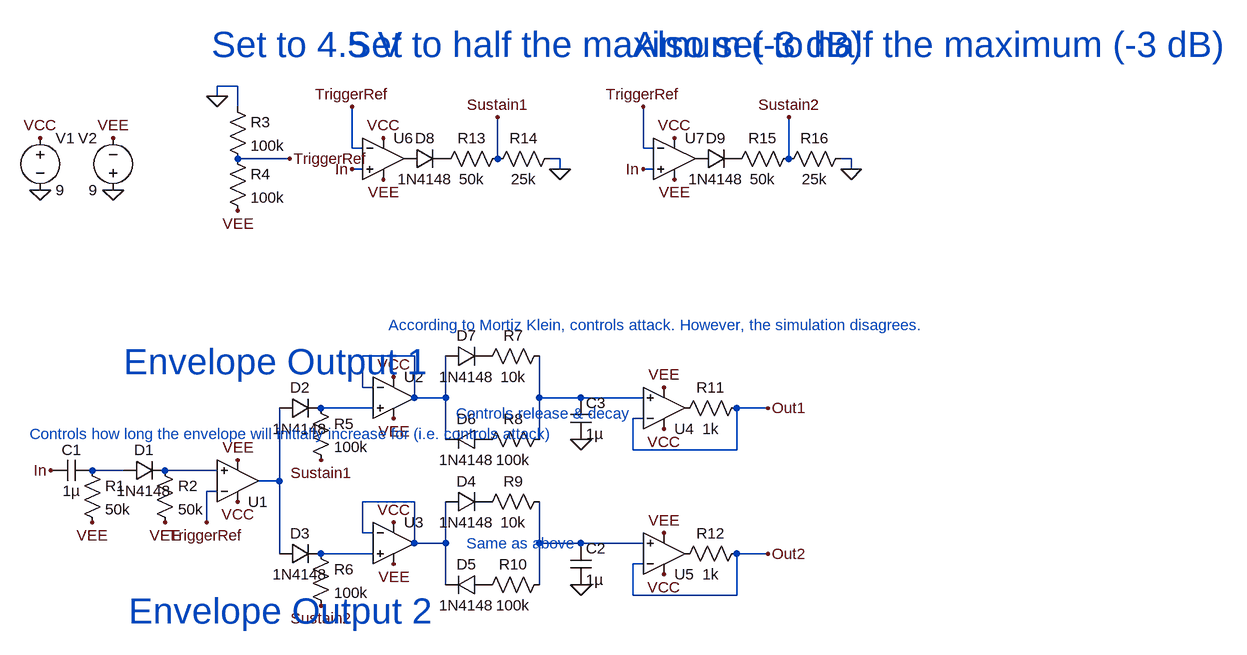
[diagram p0: schematic Envelope Generator.asc]
Envelope Generator.asc, the LTspice schematic file:
Version 4.1
SHEET 1 1356 680
WIRE 336 -496 304 -496
WIRE 304 -480 304 -496
WIRE 336 -464 336 -496
WIRE 512 -400 512 -464
WIRE 528 -400 512 -400
WIRE 960 -400 960 -464
WIRE 976 -400 960 -400
WIRE 416 -384 336 -384
WIRE 736 -384 736 -448
WIRE 832 -384 816 -384
WIRE 1184 -384 1184 -448
WIRE 1280 -384 1264 -384
WIRE 528 -368 512 -368
WIRE 832 -368 832 -384
WIRE 976 -368 960 -368
WIRE 1280 -368 1280 -384
WIRE 608 -80 528 -80
WIRE 528 -32 528 -80
WIRE 544 -32 528 -32
WIRE 608 -16 608 -80
WIRE 656 -16 656 -80
WIRE 656 -16 608 -16
WIRE 800 -16 800 -80
WIRE 864 -16 800 -16
WIRE 960 -16 864 -16
WIRE 544 0 464 0
WIRE 1152 0 1104 0
WIRE 960 16 944 16
WIRE 656 48 656 -16
WIRE 800 48 800 -16
WIRE 944 64 944 16
WIRE 1104 64 1104 0
WIRE 1104 64 944 64
WIRE 160 96 112 96
WIRE 304 96 224 96
WIRE 400 112 400 0
WIRE 400 112 368 112
WIRE 304 128 288 128
WIRE 608 144 528 144
WIRE 288 176 288 128
WIRE 528 192 528 144
WIRE 544 192 528 192
WIRE 608 208 608 144
WIRE 656 208 656 144
WIRE 656 208 608 208
WIRE 800 208 800 144
WIRE 864 208 800 208
WIRE 960 208 864 208
WIRE 400 224 400 112
WIRE 544 224 464 224
WIRE 1152 224 1104 224
WIRE 960 240 944 240
WIRE 656 272 656 208
WIRE 800 272 800 208
WIRE 944 288 944 240
WIRE 1104 288 1104 224
WIRE 1104 288 944 288
FLAG 48 96 In
FLAG 288 176 TriggerRef
FLAG 336 144 VCC
FLAG 336 80 VEE
FLAG 304 -480 0
FLAG 336 -304 VEE
FLAG 416 -384 TriggerRef
FLAG 32 -336 0
FLAG 144 -336 0
FLAG 144 -416 VEE
FLAG 32 -416 VCC
FLAG 464 80 Sustain1
FLAG 464 304 Sustain2
FLAG 576 -48 VCC
FLAG 576 176 VCC
FLAG 576 16 VEE
FLAG 576 240 VEE
FLAG 864 48 0
FLAG 864 272 0
FLAG 992 -32 VEE
FLAG 992 32 VCC
FLAG 992 192 VEE
FLAG 992 256 VCC
FLAG 1152 0 Out1
FLAG 1152 224 Out2
FLAG 512 -464 TriggerRef
FLAG 512 -368 In
FLAG 832 -368 0
FLAG 736 -448 Sustain1
FLAG 560 -416 VCC
FLAG 560 -352 VEE
FLAG 960 -464 TriggerRef
FLAG 960 -368 In
FLAG 1280 -368 0
FLAG 1184 -448 Sustain2
FLAG 1008 -416 VCC
FLAG 1008 -352 VEE
FLAG 224 176 VEE
FLAG 112 176 VEE
SYMBOL cap 112 80 R90
WINDOW 0 0 32 VBottom 2
WINDOW 3 32 32 VTop 2
SYMATTR InstName C1
SYMATTR Value 1µ
SYMBOL res 96 80 R0
SYMATTR InstName R1
SYMATTR Value 50k
SYMBOL diode 160 112 R270
WINDOW 0 32 32 VTop 2
WINDOW 3 0 32 VBottom 2
SYMATTR InstName D1
SYMATTR Value 1N4148
SYMBOL res 208 80 R0
SYMATTR InstName R2
SYMATTR Value 50k
SYMBOL OpAmps\\UniversalOpAmp2 336 112 M180
SYMATTR InstName U1
SYMBOL res 320 -480 R0
SYMATTR InstName R3
SYMATTR Value 100k
SYMBOL res 320 -400 R0
SYMATTR InstName R4
SYMATTR Value 100k
SYMBOL voltage 32 -432 R0
WINDOW 123 0 0 Left 0
WINDOW 39 0 0 Left 0
SYMATTR InstName V1
SYMATTR Value 9
SYMBOL voltage 144 -320 R180
WINDOW 0 24 96 Left 2
WINDOW 3 24 16 Left 2
WINDOW 123 0 0 Left 0
WINDOW 39 0 0 Left 0
SYMATTR InstName V2
SYMATTR Value 9
SYMBOL diode 400 16 R270
WINDOW 0 32 32 VTop 2
WINDOW 3 0 32 VBottom 2
SYMATTR InstName D2
SYMATTR Value 1N4148
SYMBOL diode 400 240 R270
WINDOW 0 32 32 VTop 2
WINDOW 3 0 32 VBottom 2
SYMATTR InstName D3
SYMATTR Value 1N4148
SYMBOL res 448 -16 R0
SYMATTR InstName R5
SYMATTR Value 100k
SYMBOL res 448 208 R0
SYMATTR InstName R6
SYMATTR Value 100k
SYMBOL OpAmps\\UniversalOpAmp2 576 -16 R0
SYMATTR InstName U2
SYMBOL OpAmps\\UniversalOpAmp2 576 208 R0
SYMATTR InstName U3
SYMBOL diode 656 160 R270
WINDOW 0 32 32 VTop 2
WINDOW 3 0 32 VBottom 2
SYMATTR InstName D4
SYMATTR Value 1N4148
SYMBOL diode 720 256 R90
WINDOW 0 0 32 VBottom 2
WINDOW 3 32 32 VTop 2
SYMATTR InstName D5
SYMATTR Value 1N4148
SYMBOL diode 720 32 R90
WINDOW 0 0 32 VBottom 2
WINDOW 3 32 32 VTop 2
SYMATTR InstName D6
SYMATTR Value 1N4148
SYMBOL diode 656 -64 R270
WINDOW 0 32 32 VTop 2
WINDOW 3 0 32 VBottom 2
SYMATTR InstName D7
SYMATTR Value 1N4148
SYMBOL res 816 -96 R90
WINDOW 0 0 56 VBottom 2
WINDOW 3 32 56 VTop 2
SYMATTR InstName R7
SYMATTR Value 10k
SYMBOL res 816 32 R90
WINDOW 0 0 56 VBottom 2
WINDOW 3 32 56 VTop 2
SYMATTR InstName R8
SYMATTR Value 100k
SYMBOL res 816 128 R90
WINDOW 0 0 56 VBottom 2
WINDOW 3 32 56 VTop 2
SYMATTR InstName R9
SYMATTR Value 10k
SYMBOL res 816 256 R90
WINDOW 0 0 56 VBottom 2
WINDOW 3 32 56 VTop 2
SYMATTR InstName R10
SYMATTR Value 100k
SYMBOL cap 848 208 R0
SYMATTR InstName C2
SYMATTR Value 1µ
SYMBOL cap 848 -16 R0
SYMATTR InstName C3
SYMATTR Value 1µ
SYMBOL OpAmps\\UniversalOpAmp2 992 0 M180
SYMATTR InstName U4
SYMBOL res 1120 -16 R90
WINDOW 0 0 56 VBottom 2
WINDOW 3 32 56 VTop 2
SYMATTR InstName R11
SYMATTR Value 1k
SYMBOL OpAmps\\UniversalOpAmp2 992 224 M180
SYMATTR InstName U5
SYMBOL res 1120 208 R90
WINDOW 0 0 56 VBottom 2
WINDOW 3 32 56 VTop 2
SYMATTR InstName R12
SYMATTR Value 1k
SYMBOL OpAmps\\UniversalOpAmp2 560 -384 R0
SYMATTR InstName U6
SYMBOL diode 592 -368 R270
WINDOW 0 32 32 VTop 2
WINDOW 3 0 32 VBottom 2
SYMATTR InstName D8
SYMATTR Value 1N4148
SYMBOL res 752 -400 R90
WINDOW 0 0 56 VBottom 2
WINDOW 3 32 56 VTop 2
SYMATTR InstName R13
SYMATTR Value 50k
SYMBOL res 832 -400 R90
WINDOW 0 0 56 VBottom 2
WINDOW 3 32 56 VTop 2
SYMATTR InstName R14
SYMATTR Value 25k
SYMBOL OpAmps\\UniversalOpAmp2 1008 -384 R0
SYMATTR InstName U7
SYMBOL diode 1040 -368 R270
WINDOW 0 32 32 VTop 2
WINDOW 3 0 32 VBottom 2
SYMATTR InstName D9
SYMATTR Value 1N4148
SYMBOL res 1200 -400 R90
WINDOW 0 0 56 VBottom 2
WINDOW 3 32 56 VTop 2
SYMATTR InstName R15
SYMATTR Value 50k
SYMBOL res 1280 -400 R90
WINDOW 0 0 56 VBottom 2
WINDOW 3 32 56 VTop 2
SYMATTR InstName R16
SYMATTR Value 25k
TEXT 296 -560 Left 5 ;Set to 4.5 V
TEXT 504 -560 Left 5 ;Set to half the maximum (-3 dB)
TEXT 944 -560 Left 5 ;Also set to half the maximum (-3 dB)
TEXT 160 -72 Left 5 ;Envelope Output 1
TEXT 168 312 Left 5 ;Envelope Output 2
TEXT 672 8 Left 2 ;Controls release & decay
TEXT 568 -128 Left 2 ;According to Mortiz Klein, controls attack. However, the simulation disagrees.
TEXT 688 208 Left 2 ;Same as above
TEXT 16 40 Left 2 ;Controls how long the envelope will initially increase for (i.e. controls attack)

The netlist it stands for:
* Envelope Generator.asc
C1 N004 In 1µ
R1 N004 VEE 50k
D1 N004 N005 1N4148
R2 N005 VEE 50k
X§U1 N005 TriggerRef VCC VEE N006 level2 Avol=1Meg GBW=10Meg Slew=10Meg Ilimit=25m Rail=0 Vos=0 En=0 Enk=0 In=0 Ink=0 Rin=500Meg  ; pins In+ In- V+ V- OUT
R3 0 TriggerRef 100k
R4 TriggerRef VEE 100k
V1 VCC 0 9
V2 0 VEE 9
D2 N006 N003 1N4148
D3 N006 N009 1N4148
R5 N003 Sustain1 100k
R6 N009 Sustain2 100k
X§U2 N003 N001 VCC VEE N001 level2 Avol=1Meg GBW=10Meg Slew=10Meg Ilimit=25m Rail=0 Vos=0 En=0 Enk=0 In=0 Ink=0 Rin=500Meg  ; pins In+ In- V+ V- OUT
X§U3 N009 N007 VCC VEE N007 level2 Avol=1Meg GBW=10Meg Slew=10Meg Ilimit=25m Rail=0 Vos=0 En=0 Enk=0 In=0 Ink=0 Rin=500Meg  ; pins In+ In- V+ V- OUT
D4 N007 P001 1N4148
D5 P002 N007 1N4148
D6 P003 N001 1N4148
D7 N001 P004 1N4148
R7 N002 P004 10k
R8 N002 P003 100k
R9 N008 P001 10k
R10 N008 P002 100k
C2 N008 0 1µ
C3 N002 0 1µ
X§U4 N002 Out1 VCC VEE P005 level2 Avol=1Meg GBW=10Meg Slew=10Meg Ilimit=25m Rail=0 Vos=0 En=0 Enk=0 In=0 Ink=0 Rin=500Meg  ; pins In+ In- V+ V- OUT
R11 Out1 P005 1k
X§U5 N008 Out2 VCC VEE P006 level2 Avol=1Meg GBW=10Meg Slew=10Meg Ilimit=25m Rail=0 Vos=0 En=0 Enk=0 In=0 Ink=0 Rin=500Meg  ; pins In+ In- V+ V- OUT
R12 Out2 P006 1k
X§U6 In TriggerRef VCC VEE P007 level2 Avol=1Meg GBW=10Meg Slew=10Meg Ilimit=25m Rail=0 Vos=0 En=0 Enk=0 In=0 Ink=0 Rin=500Meg  ; pins In+ In- V+ V- OUT
D8 P007 P008 1N4148
R13 Sustain1 P008 50k
R14 0 Sustain1 25k
X§U7 In TriggerRef VCC VEE P009 level2 Avol=1Meg GBW=10Meg Slew=10Meg Ilimit=25m Rail=0 Vos=0 En=0 Enk=0 In=0 Ink=0 Rin=500Meg  ; pins In+ In- V+ V- OUT
D9 P009 P010 1N4148
R15 Sustain2 P010 50k
R16 0 Sustain2 25k
.model D D
.lib standard.dio
* Set to 4.5 V
* Set to half the maximum (-3 dB)
* Also set to half the maximum (-3 dB)
* Envelope Output 1
* Envelope Output 2
* Controls release & decay
* According to Mortiz Klein, controls attack. However, the simulation disagrees.
* Same as above
* Controls how long the envelope will initially increase for (i.e. controls attack)
.lib UniversalOpAmp2.lib
.backanno
.end